# Altium schematic sheet VISUR-botI_b.SchDoc: VISUR-I
size 420 x 297 mm; Address1: Address1; Address2: Address2; Address3: Address3; Address4: Address4; DocumentNumber: АБВГ.123456.001 Э3; SheetNumber: 1; Scale: 1:1; DocumentType: Схема электрическая принципиальная; FirstReferrence: АБВГ.123456.001
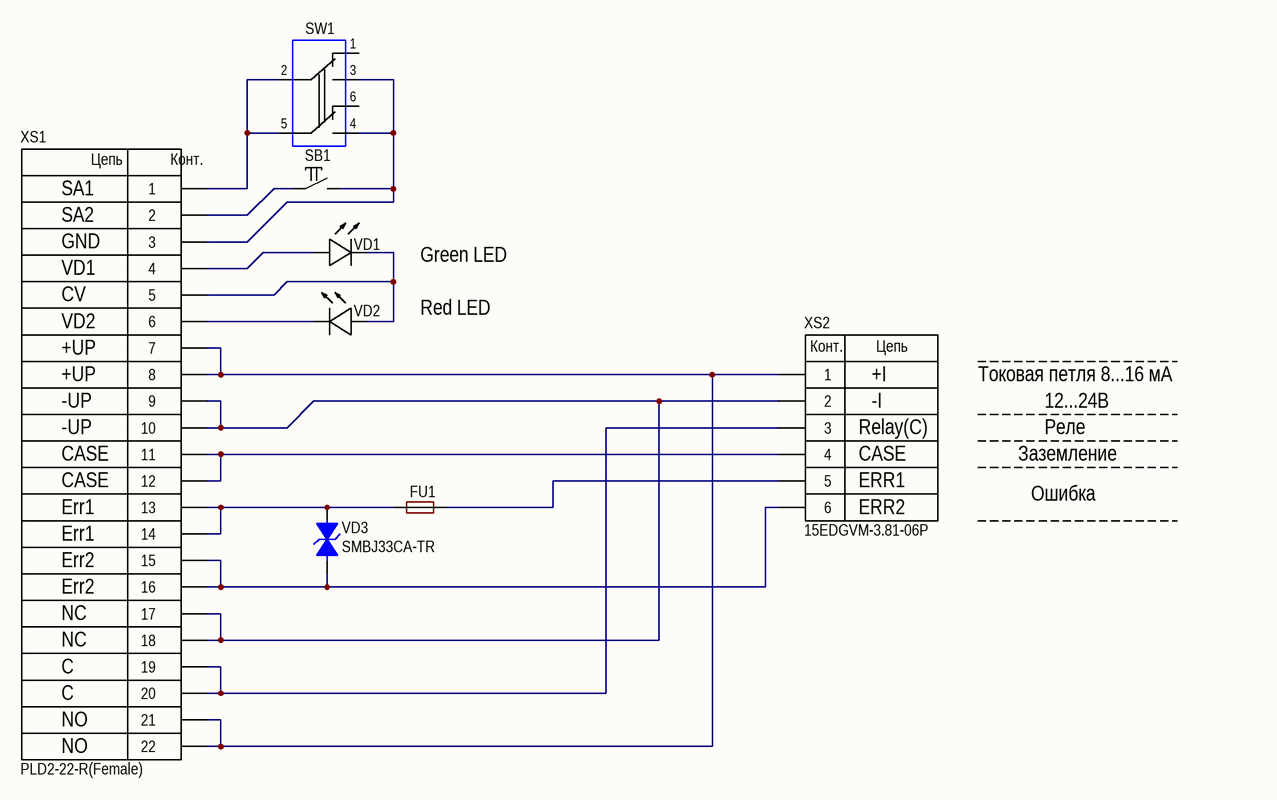
[diagram p0: VISUR-botI_b.SchDoc]

## Parts
FU1  (no value)  [FUSE: 1812]
SB1  (no value)  [BUT: 6x6]
SW1  JS202011SCQN  [JS202011CQN]  (value not drawn)
VD1  KM2520SURCK09  [KM2520SURCK09]  (value not drawn)
VD2  KM2520SURCK09  [KM2520SURCK09]  (value not drawn)
VD3  SMBJ33CA-TR  [DIODE: SMB]
XS1  PLD2-22-R(Female)  [CON: PLD2-22-R(Female)]
XS2  15EDGVM-3.81-06P  [CON: 15EDGVM-3.81-06P]

## Nets
NetFU1_1: FU1.1 VD3.2 XS1.13 XS1.14
NetFU1_2: FU1.2 XS2.5
NetSB1_1: SB1.1 XS1.2
NetSB1_2: SB1.2 SW1.3 SW1.4 XS1.3
NetSW1_2: SW1.2 SW1.5 XS1.1
NetVD1_1: VD1.1(A) XS1.4
NetVD1_2: VD1.2(K) VD2.1(A) XS1.5
NetVD2_2: VD2.2(K) XS1.6
NetVD3_1: VD3.1 XS1.15 XS1.16 XS2.6
NetXS1_7: XS1.7 XS1.8 XS1.21 XS1.22 XS2.1
NetXS1_9: XS1.9 XS1.10 XS1.17 XS1.18 XS2.2
NetXS1_11: XS1.11 XS1.12 XS2.4
NetXS1_19: XS1.19 XS1.20 XS2.3

Not connected (* = marked no-connect by the designer): SW1 1 6

## Notes on the sheet
- SA1
- SA2
- GND
- VD1
- CV
- Green LED
- Red LED
- VD2
- +UP
- +I
- Токовая петля 8...16 мА
- -UP
- (near XS2) Relay(C)
- -I
- 12...24В
- Реле
- CASE
- Err1
- (near XS2) CASE
- (near XS2) ERR1
- (near XS2) ERR2
- Заземление
- Ошибка
- Err2
- NC
- C
- NO
- Перв. примен.
- Справ. №
- Подп. и дата
- Инв. № дубл.
- Взам. инв. №
- Разраб.
- Изм.
- Лист
- № докум.
- Подп.
- Дата
- Лит.
- Масса
- Масштаб
- Пров.
- Т.контр.
- Листов
- Инв. № подл.
- Утв.
- Н.контр.
- 2.106-A3
- Копировал
- Формат А3
- (in symbol 15EDGVM-3.81-06P) Конт.; Цепь
- (in symbol PLD2-22(Female)) Цепь; Конт.

## Library data of the parts
FU1 = Fuse: Manufacturer: Littelfuse; PartNumber: 01110501Z; TypeFuse: Electromechanics relay; VoltageMax: 250VAC; Package: 5x20mm; HelpURL: https://www.digikey.com/products/en?keywords=01110501Z; ValueManufacturerPartNumber: =TypeFuse+', '+VoltageMax+', '+MaxCurrent+', '+Package+', '+Temperature
SB1 = Button_tactile: Manufacturer: TE Connectivity; ValueManufacturerPartNumber: Tactile button, 6x6mm; PartNumber: FSM2JSMAATR; TypeButton: Tactile button; CommentText: "Кнопка"; Package: 6x6mm; ComponentLink1Description: Datasheet(6x6); ComponentLink1URL: https://static.chipdip.ru/lib/551/DOC001551938.pdf
SW1 = JS202011SCQN: Переключатель; Manufacturer: C&K Component; ReplacementPart1Manufacturer: Китай; ReplacementPart1PartNumber: is-1390; ComponentLink1Description: Data Sheet; ComponentLink1URL: https://ru.mouser.com/datasheet/2/60/js-1841892.pdf; ComponentLink2Description: Replacement 1 DataSheet
VD1 VD2 = KM2520SURCK09: LED
VD3 = SMBJ10CA-TR
XS1 = PLD2-22(Female): ComponentLink1Description: Datasheet; ComponentLink1URL: https://www.compel.ru/item-pdf/1e1366ded138976aeb89dd182fa987b9/ps/kls~kls1-207b.pdf
XS2 = 15EDGVM-3.81-06P: ComponentLink1Description: Datasheet; ComponentLink1URL: https://www.phoenixcontact.com/online/portal/ru/?uri=pxc-oc-itemdetail:pid=1830635&library=&pcck=P-11-02-11&tab=1&selectedCategory=ALL